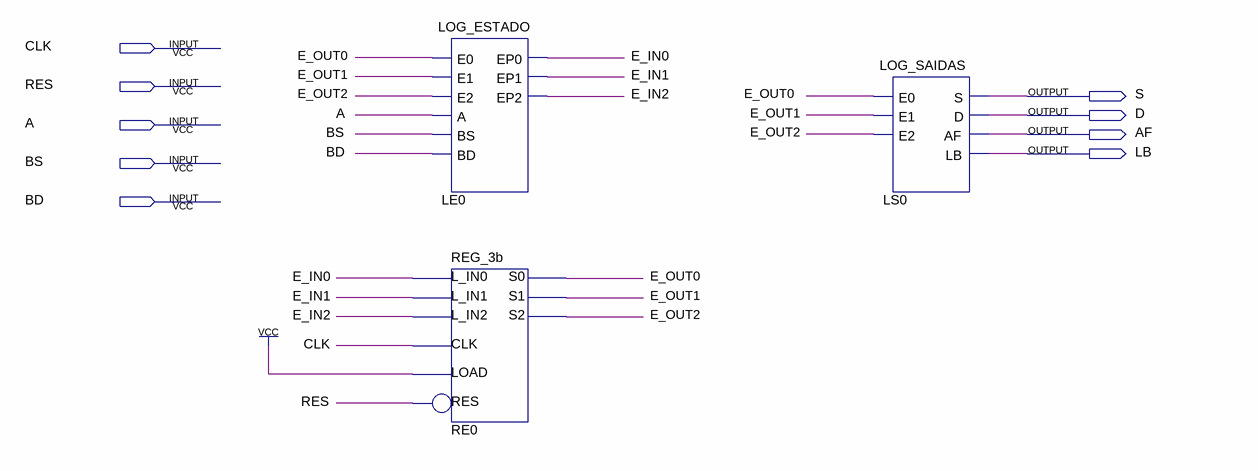
[diagram p0: schematic sheet]
// Quartus schematic FSM_ELE.bdf as structural Verilog: 3 symbols, 9 pins
module FSM_ELE (
  input  CLK,
  input  RES,
  input  A,
  input  BS,
  input  BD,
  output S,
  output D,
  output AF,
  output LB
);

  wire E_IN0, E_IN1, E_IN2, E_OUT0, E_OUT1, E_OUT2;

  LOG_ESTADO LE0 (
    .E0(E_OUT0), .E1(E_OUT1), .E2(E_OUT2), .A(A), .BS(BS), .BD(BD), .EP0(E_IN0), .EP1(E_IN1), .EP2(E_IN2));
  REG_3b RE0 (
    .L_IN0(E_IN0), .L_IN1(E_IN1), .L_IN2(E_IN2), .LOAD(1'b1), .CLK(CLK), .RES(RES), .S0(E_OUT0), .S1(E_OUT1),
    .S2(E_OUT2));
  LOG_SAIDAS LS0 (.E0(E_OUT0), .E1(E_OUT1), .E2(E_OUT2), .S(S), .D(D), .AF(AF), .LB(LB));
endmodule
